# Altium schematic sheet USB.SchDoc
size A4; SheetNumber: 5; SheetTotal: 8
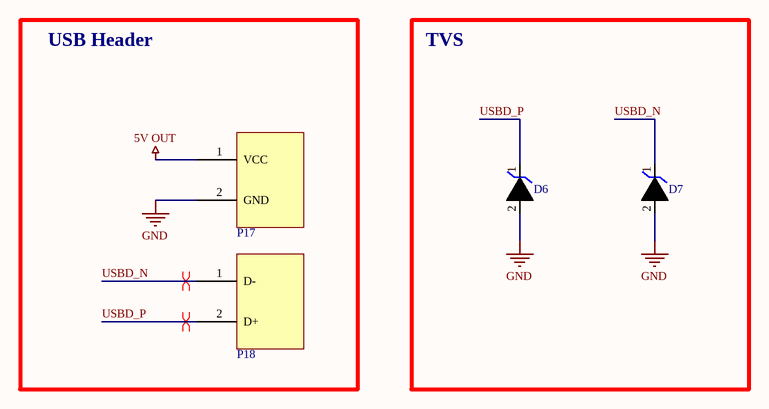
[diagram p0: USB.SchDoc]

## Parts
D6  TVS  [TVS DIODE]  (value not drawn)
D7  TVS  [TVS DIODE]  (value not drawn)
P17  2-Pin Header  [WR-TBL 322 2H]  (value not drawn)
P18  2-Pin Header  [WR-TBL 322 2H]  (value not drawn)

## Blocks framed on the sheet
USB Header: P17 P18
TVS: D6 D7

## Nets
5V OUT: P17.1(VCC)
GND: D6.2 D7.2 P17.2(GND)
USBD_N: D7.1 P18.1(D-)
USBD_P: D6.1 P18.2(D+)

## Layout directives
differential pair: USBD_N, USBD_P

## Library data of the parts
D6 D7 = TVS Diode: Schematic for TVS diode
P17 P18 = 322-2H: 322 series 2 pin header